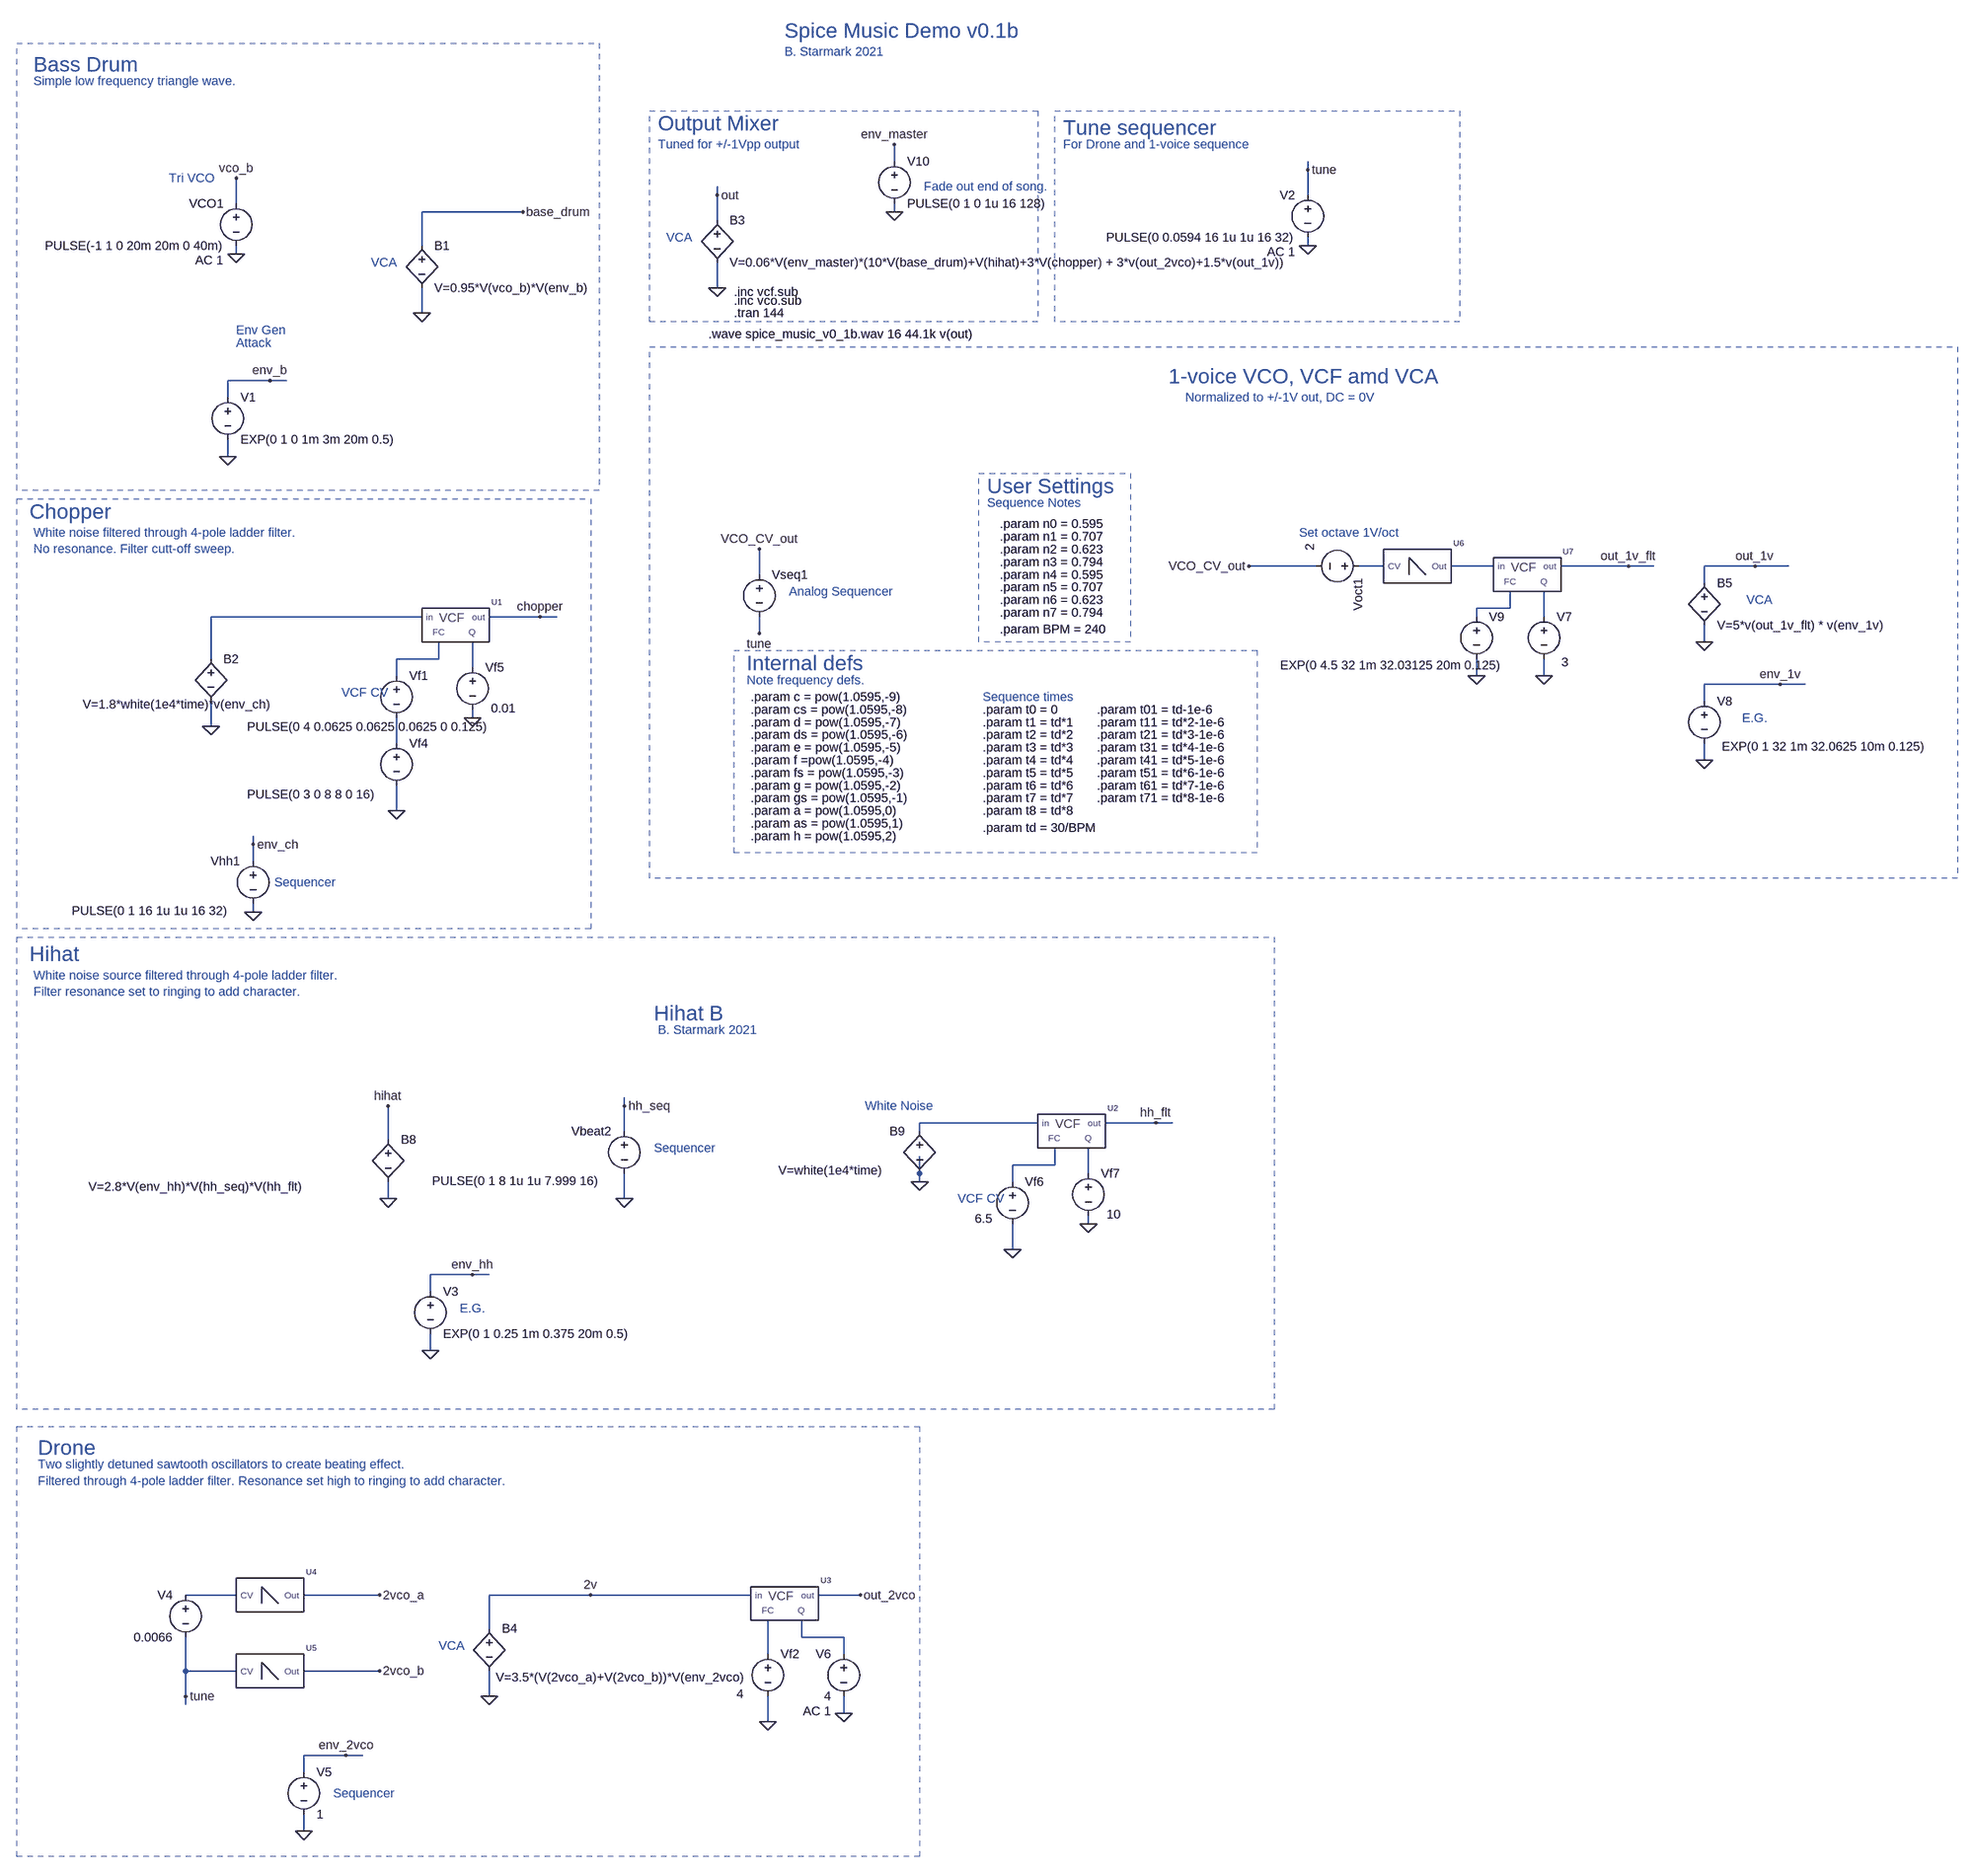
[diagram p0: schematic spice_music_v0_1b.asc]
spice_music_v0_1b.asc, the LTspice schematic file:
Version 4
SHEET 1 1780 5468
WIRE -240 -784 -240 -816
WIRE 544 -768 544 -784
WIRE -576 -720 -576 -736
WIRE 544 -720 544 -768
WIRE -1488 -704 -1488 -752
WIRE -944 -688 -1136 -688
WIRE -240 -688 -240 -704
WIRE -576 -672 -576 -720
WIRE -1136 -624 -1136 -688
WIRE 544 -624 544 -640
WIRE -1488 -608 -1488 -624
WIRE -576 -544 -576 -592
WIRE -1136 -496 -1136 -544
WIRE -1424 -368 -1504 -368
WIRE -1392 -368 -1424 -368
WIRE -1504 -336 -1504 -368
WIRE -1504 -224 -1504 -256
WIRE 560 -16 432 -16
WIRE 688 -16 640 -16
WIRE 896 -16 816 -16
WIRE 1152 -16 1024 -16
WIRE 1200 -16 1152 -16
WIRE 1392 -16 1296 -16
WIRE 1456 -16 1392 -16
WIRE -496 0 -496 -48
WIRE 1296 16 1296 -16
WIRE 928 64 928 32
WIRE 928 64 864 64
WIRE -1136 80 -1536 80
WIRE -912 80 -1008 80
WIRE -880 80 -912 80
WIRE 864 80 864 64
WIRE 992 80 992 32
WIRE -496 112 -496 80
WIRE 1296 128 1296 96
WIRE -1536 160 -1536 80
WIRE -1104 160 -1104 128
WIRE -1104 160 -1184 160
WIRE -1040 176 -1040 128
WIRE -1184 192 -1184 160
WIRE 864 192 864 160
WIRE 992 192 992 160
WIRE 1440 208 1296 208
WIRE 1488 208 1440 208
WIRE 1296 240 1296 208
WIRE -1040 272 -1040 256
WIRE -1536 288 -1536 240
WIRE -1184 320 -1184 272
WIRE 1296 352 1296 320
WIRE -1184 448 -1184 400
WIRE -1456 512 -1456 496
WIRE -1456 544 -1456 512
WIRE -1456 640 -1456 624
WIRE -752 1008 -752 992
WIRE 32 1040 -192 1040
WIRE 256 1040 160 1040
WIRE 288 1040 256 1040
WIRE -752 1056 -752 1008
WIRE -192 1056 -192 1040
WIRE -1200 1072 -1200 1008
WIRE 64 1120 64 1088
WIRE 64 1120 -16 1120
WIRE -192 1136 -192 1104
WIRE 128 1136 128 1088
WIRE -192 1152 -192 1136
WIRE -16 1152 -16 1120
WIRE -1200 1184 -1200 1152
WIRE -752 1184 -752 1136
WIRE 128 1232 128 1216
WIRE -16 1280 -16 1232
WIRE -1040 1328 -1120 1328
WIRE -1008 1328 -1040 1328
WIRE -1120 1360 -1120 1328
WIRE -1120 1472 -1120 1440
WIRE -1488 1936 -1584 1936
WIRE -1216 1936 -1360 1936
WIRE -816 1936 -1008 1936
WIRE -512 1936 -816 1936
WIRE -304 1936 -384 1936
WIRE -1008 2000 -1008 1936
WIRE -416 2016 -416 1984
WIRE -336 2016 -416 2016
WIRE -480 2048 -480 1984
WIRE -336 2048 -336 2016
WIRE -1584 2080 -1584 2016
WIRE -1488 2080 -1584 2080
WIRE -1216 2080 -1360 2080
WIRE -1584 2128 -1584 2080
WIRE -1008 2128 -1008 2080
WIRE -1584 2144 -1584 2128
WIRE -336 2160 -336 2128
WIRE -480 2176 -480 2128
WIRE -1280 2240 -1360 2240
WIRE -1248 2240 -1280 2240
WIRE -1360 2272 -1360 2240
WIRE -1360 2384 -1360 2352
FLAG -576 -544 0
FLAG -576 -720 out
FLAG -1456 640 0
FLAG -1456 512 env_ch
FLAG -1488 -608 0
FLAG -1136 -496 0
FLAG -1488 -752 vco_b
FLAG -944 -688 base_drum
FLAG -1504 -224 0
FLAG -1424 -368 env_b
FLAG -1536 288 0
FLAG -912 80 chopper
FLAG -1184 448 0
FLAG -1040 272 0
FLAG -1200 1008 hihat
FLAG -752 1184 0
FLAG -752 1008 hh_seq
FLAG -1200 1184 0
FLAG 256 1040 hh_flt
FLAG -192 1152 0
FLAG -1120 1472 0
FLAG -1040 1328 env_hh
FLAG 128 1232 0
FLAG -16 1280 0
FLAG -1008 2128 0
FLAG -816 1936 2v
FLAG -1360 2384 0
FLAG -1280 2240 env_2vco
FLAG -304 1936 out_2vco
FLAG -336 2160 0
FLAG -480 2176 0
FLAG -1216 1936 2vco_a
FLAG 544 -624 0
FLAG -1216 2080 2vco_b
FLAG 1296 128 0
FLAG 1392 -16 out_1v
FLAG -496 -48 VCO_CV_out
FLAG 432 -16 VCO_CV_out
FLAG 864 192 0
FLAG 992 192 0
FLAG 1152 -16 out_1v_flt
FLAG 1296 352 0
FLAG 1440 208 env_1v
FLAG 544 -768 tune
FLAG -1584 2128 tune
FLAG -496 112 tune
FLAG -240 -688 0
FLAG -240 -816 env_master
SYMBOL bv -576 -688 R0
SYMATTR InstName B3
SYMATTR Value V=0.06*V(env_master)*(10*V(base_drum)+V(hihat)+3*V(chopper) + 3*v(out_2vco)+1.5*v(out_1v))
SYMBOL voltage -1456 528 M0
WINDOW 123 24 124 Left 2
WINDOW 39 0 0 Left 2
WINDOW 3 47 110 Left 2
SYMATTR Value PULSE(0 1 16 1u 1u 16 32)
SYMATTR InstName Vhh1
SYMBOL voltage -1488 -720 M0
WINDOW 123 24 124 Left 2
WINDOW 39 0 0 Left 2
SYMATTR Value2 AC 1
SYMATTR InstName VCO1
SYMATTR Value PULSE(-1 1 0 20m 20m 0 40m)
SYMBOL bv -1136 -640 R0
SYMATTR InstName B1
SYMATTR Value V=0.95*V(vco_b)*V(env_b)
SYMBOL voltage -1504 -352 R0
WINDOW 123 0 0 Left 0
WINDOW 39 0 0 Left 0
SYMATTR InstName V1
SYMATTR Value EXP(0 1 0 1m 3m 20m 0.5)
SYMBOL voltage -1184 176 R0
WINDOW 123 0 0 Left 0
WINDOW 39 0 0 Left 0
WINDOW 3 -283 113 Left 2
SYMATTR Value PULSE(0 4 0.0625 0.0625 0.0625 0 0.125)
SYMATTR InstName Vf1
SYMBOL bv -1536 144 R0
WINDOW 3 -243 102 Left 2
SYMATTR Value V=1.8*white(1e4*time)*v(env_ch)
SYMATTR InstName B2
SYMBOL voltage -1184 304 R0
WINDOW 123 0 0 Left 0
WINDOW 39 0 0 Left 0
WINDOW 3 -283 113 Left 2
SYMATTR Value PULSE(0 3 0 8 8 0 16)
SYMATTR InstName Vf4
SYMBOL vcf -1072 48 R0
SYMATTR InstName U1
SYMBOL voltage -1040 160 R0
WINDOW 123 0 0 Left 0
WINDOW 39 0 0 Left 0
WINDOW 3 35 94 Left 2
SYMATTR Value 0.01
SYMATTR InstName Vf5
SYMBOL bv -1200 1056 R0
WINDOW 3 -568 105 Left 2
SYMATTR Value V=2.8*V(env_hh)*V(hh_seq)*V(hh_flt)
SYMATTR InstName B8
SYMBOL voltage -752 1040 M0
WINDOW 123 24 124 Left 2
WINDOW 39 0 0 Left 2
WINDOW 3 47 110 Left 2
SYMATTR Value PULSE(0 1 8 1u 1u 7.999 16)
SYMATTR InstName Vbeat2
SYMBOL bv -192 1040 R0
WINDOW 0 -57 16 Left 2
WINDOW 3 -268 90 Left 2
SYMATTR InstName B9
SYMATTR Value V=white(1e4*time)
SYMBOL voltage -1120 1344 R0
WINDOW 123 0 0 Left 0
WINDOW 39 0 0 Left 0
SYMATTR InstName V3
SYMATTR Value EXP(0 1 0.25 1m 0.375 20m 0.5)
SYMBOL voltage -16 1136 R0
WINDOW 123 0 0 Left 0
WINDOW 39 0 0 Left 0
WINDOW 3 -71 86 Left 2
SYMATTR Value 6.5
SYMATTR InstName Vf6
SYMBOL vcf 96 1008 R0
SYMATTR InstName U2
SYMBOL voltage 128 1120 R0
WINDOW 123 0 0 Left 0
WINDOW 39 0 0 Left 0
WINDOW 3 35 94 Left 2
SYMATTR Value 10
SYMATTR InstName Vf7
SYMBOL bv -1008 1984 R0
WINDOW 3 12 108 Left 2
SYMATTR Value V=3.5*(V(2vco_a)+V(2vco_b))*V(env_2vco)
SYMATTR InstName B4
SYMBOL voltage -480 2032 R0
WINDOW 123 0 0 Left 0
WINDOW 39 0 0 Left 0
WINDOW 3 -59 92 Left 2
SYMATTR Value 4
SYMATTR InstName Vf2
SYMBOL voltage -1360 2256 R0
WINDOW 123 0 0 Left 0
WINDOW 39 0 0 Left 0
SYMATTR InstName V5
SYMATTR Value 1
SYMBOL vcf -448 1904 R0
SYMATTR InstName U3
SYMBOL voltage -336 2032 M0
WINDOW 123 24 124 Left 2
WINDOW 39 0 0 Left 2
SYMATTR Value2 AC 1
SYMATTR InstName V6
SYMATTR Value 4
SYMBOL voltage 544 -736 M0
WINDOW 123 24 124 Left 2
WINDOW 39 0 0 Left 2
SYMATTR Value2 AC 1
SYMATTR InstName V2
SYMATTR Value PULSE(0 0.0594 16 1u 1u 16 32)
SYMBOL voltage -1584 1920 M0
WINDOW 123 24 124 Left 2
WINDOW 39 0 0 Left 2
SYMATTR InstName V4
SYMATTR Value 0.0066
SYMBOL vco -1424 1888 R0
SYMATTR InstName U4
SYMBOL vco -1424 2032 R0
SYMATTR InstName U5
SYMBOL bv 1296 0 R0
SYMATTR InstName B5
SYMATTR Value V=5*v(out_1v_flt) * v(env_1v)
SYMBOL voltage -496 -16 R0
WINDOW 3 28 110 Invisible 2
SYMATTR Value PWL REPEAT FOREVER ({t0} {n0} {t01} {n0} {t1} {n1} {t11} {n1} {t2} {n2} {t21} {n2} {t3} {n3} {t31} {n3} {t4} {n4} {t41} {n4} {t5} {n5} {t51} {n5} {t6} {n6} {t61} {n6} {t7} {n7} {t71} {n7} {t8} {n0}) ENDREPEAT
SYMATTR InstName Vseq1
SYMBOL vco 752 -64 R0
SYMATTR InstName U6
SYMBOL vcf 960 -48 R0
SYMATTR InstName U7
SYMBOL voltage 992 64 R0
WINDOW 123 0 0 Left 0
WINDOW 39 0 0 Left 0
WINDOW 3 33 102 Left 2
SYMATTR Value 3
SYMATTR InstName V7
SYMBOL voltage 1296 224 R0
WINDOW 123 0 0 Left 0
WINDOW 39 0 0 Left 0
WINDOW 3 33 102 Left 2
SYMATTR Value EXP(0 1 32 1m 32.0625 10m 0.125)
SYMATTR InstName V8
SYMBOL voltage 656 -16 R90
WINDOW 123 0 0 Left 0
WINDOW 39 0 0 Left 0
WINDOW 3 -43 108 Left 2
SYMATTR Value 2
SYMATTR InstName Voct1
SYMBOL voltage 864 64 R0
WINDOW 123 0 0 Left 0
WINDOW 39 0 0 Left 0
WINDOW 3 -372 108 Left 2
SYMATTR Value EXP(0 4.5 32 1m 32.03125 20m 0.125)
SYMATTR InstName V9
SYMBOL voltage -240 -800 R0
WINDOW 123 0 0 Left 0
WINDOW 39 0 0 Left 0
SYMATTR InstName V10
SYMATTR Value PULSE(0 1 0 1u 16 128)
TEXT -448 -1032 Left 4 ;Spice Music Demo v0.1b
TEXT -448 -992 Left 2 ;B. Starmark 2021
TEXT -1872 -968 Left 4 ;Bass Drum
TEXT -1880 -120 Left 4 ;Chopper
TEXT -672 -640 Left 2 ;VCA
TEXT -1880 720 Left 4 ;Hihat
TEXT -688 -856 Left 4 ;Output Mixer
TEXT -1864 1656 Left 4 ;Drone
TEXT -1872 760 Left 2 ;White noise source filtered through 4-pole ladder filter.\nFilter resonance set to ringing to add character.
TEXT -1872 -936 Left 2 ;Simple low frequency triangle wave.
TEXT -1872 -80 Left 2 ;White noise filtered through 4-pole ladder filter.\nNo resonance. Filter cutt-off sweep.
TEXT -1864 1688 Left 2 ;Two slightly detuned sawtooth oscillators to create beating effect.\nFiltered through 4-pole ladder filter. Resonance set high to ringing to add character.
TEXT -688 -816 Left 2 ;Tuned for +/-1Vpp output
TEXT -1488 -440 Left 2 ;Attack
TEXT -1232 -592 Left 2 ;VCA
TEXT -1488 -464 Left 2 ;Env Gen
TEXT -1616 -752 Left 2 ;Tri VCO
TEXT -1288 224 Left 2 ;VCF CV
TEXT -696 1088 Left 2 ;Sequencer
TEXT -296 1008 Left 2 ;White Noise
TEXT -696 832 Left 4 ;Hihat B
TEXT -688 864 Left 2 ;B. Starmark 2021
TEXT -120 1184 Left 2 ;VCF CV
TEXT -1104 2032 Left 2 ;VCA
TEXT -544 -536 Left 2 !.inc vcf.sub
TEXT -592 -456 Left 2 !.wave spice_music_v0_1b.wav 16 44.1k v(out)
TEXT -544 -520 Left 2 !.inc vco.sub
TEXT -544 -496 Left 2 !.tran 144
TEXT 280 -376 Left 4 ;1-voice VCO, VCF amd VCA
TEXT 312 -336 Left 2 ;Normalized to +/-1V out, DC = 0V
TEXT -440 32 Left 2 ;Analog Sequencer
TEXT -520 200 Left 2 ;Note frequency defs.
TEXT -64 -136 Left 2 ;Sequence Notes
TEXT -72 232 Left 2 ;Sequence times
TEXT -72 256 Left 2 !.param t0 = 0
TEXT 144 256 Left 2 !.param t01 = td-1e-6
TEXT -72 480 Left 2 !.param td = 30/BPM
TEXT -72 280 Left 2 !.param t1 = td*1
TEXT 144 280 Left 2 !.param t11 = td*2-1e-6
TEXT -72 304 Left 2 !.param t2 = td*2
TEXT 144 304 Left 2 !.param t21 = td*3-1e-6
TEXT 144 328 Left 2 !.param t31 = td*4-1e-6
TEXT -72 328 Left 2 !.param t3 = td*3
TEXT -72 352 Left 2 !.param t4 = td*4
TEXT 144 352 Left 2 !.param t41 = td*5-1e-6
TEXT -72 376 Left 2 !.param t5 = td*5
TEXT 144 376 Left 2 !.param t51 = td*6-1e-6
TEXT 144 400 Left 2 !.param t61 = td*7-1e-6
TEXT -72 400 Left 2 !.param t6 = td*6
TEXT 144 424 Left 2 !.param t71 = td*8-1e-6
TEXT -72 424 Left 2 !.param t7 = td*7
TEXT -520 168 Left 4 ;Internal defs
TEXT -64 -168 Left 4 ;User Settings
TEXT -72 448 Left 2 !.param t8 = td*8
TEXT 1376 48 Left 2 ;VCA
TEXT -40 -72 Left 2 !.param n1 = 0.707
TEXT -40 -48 Left 2 !.param n2 = 0.623
TEXT -40 -24 Left 2 !.param n3 = 0.794
TEXT -40 0 Left 2 !.param n4 = 0.595
TEXT -40 24 Left 2 !.param n5 = 0.707
TEXT -40 48 Left 2 !.param n6 = 0.623
TEXT -40 72 Left 2 !.param n7 = 0.794
TEXT -40 104 Left 2 !.param BPM = 240
TEXT -40 -96 Left 2 !.param n0 = 0.595
TEXT 528 -80 Left 2 ;Set octave 1V/oct
TEXT 80 -848 Left 4 ;Tune sequencer
TEXT 80 -816 Left 2 ;For Drone and 1-voice sequence
TEXT 1368 272 Left 2 ;E.G.
TEXT -1416 584 Left 2 ;Sequencer
TEXT -1064 1392 Left 2 ;E.G.
TEXT -1304 2312 Left 2 ;Sequencer
TEXT -184 -736 Left 2 ;Fade out end of song.
TEXT -512 280 Left 2 !.param d = pow(1.0595,-7)
TEXT -512 304 Left 2 !.param ds = pow(1.0595,-6)
TEXT -512 328 Left 2 !.param e = pow(1.0595,-5)
TEXT -512 352 Left 2 !.param f =pow(1.0595,-4)
TEXT -512 376 Left 2 !.param fs = pow(1.0595,-3)
TEXT -512 400 Left 2 !.param g = pow(1.0595,-2)
TEXT -512 424 Left 2 !.param gs = pow(1.0595,-1)
TEXT -512 448 Left 2 !.param a = pow(1.0595,0)
TEXT -512 472 Left 2 !.param as = pow(1.0595,1)
TEXT -512 496 Left 2 !.param h = pow(1.0595,2)
TEXT -512 256 Left 2 !.param cs = pow(1.0595,-8)
TEXT -512 232 Left 2 !.param c = pow(1.0595,-9)
RECTANGLE Normal -800 -160 -1904 -1008 2
RECTANGLE Normal -816 672 -1904 -144 2
RECTANGLE Normal 32 -480 -704 -880 2
RECTANGLE Normal 480 1584 -1904 688 2
RECTANGLE Normal -192 2432 -1904 1616 2
RECTANGLE Normal 448 528 -544 144 2
RECTANGLE Normal 208 128 -80 -192 2
RECTANGLE Normal 1776 576 -704 -432 2
RECTANGLE Normal 832 -480 64 -880 2

The netlist it stands for:
* spice_music_v0_1b.asc
B3 out 0 V=0.06*V(env_master)*(10*V(base_drum)+V(hihat)+3*V(chopper) + 3*v(out_2vco)+1.5*v(out_1v))
Vhh1 env_ch 0 PULSE(0 1 16 1u 1u 16 32)
VCO1 vco_b 0 PULSE(-1 1 0 20m 20m 0 40m) AC 1
B1 base_drum 0 V=0.95*V(vco_b)*V(env_b)
V1 env_b 0 EXP(0 1 0 1m 3m 20m 0.5)
Vf1 N006 N008 PULSE(0 4 0.0625 0.0625 0.0625 0 0.125)
B2 N004 0 V=1.8*white(1e4*time)*v(env_ch)
Vf4 N008 0 PULSE(0 3 0 8 8 0 16)
XU1 N004 chopper N006 N007 vcf  ; pins in out FC Q
Vf5 N007 0 0.01
B8 hihat 0 V=2.8*V(env_hh)*V(hh_seq)*V(hh_flt)
Vbeat2 hh_seq 0 PULSE(0 1 8 1u 1u 7.999 16)
B9 N009 0 V=white(1e4*time)
V3 env_hh 0 EXP(0 1 0.25 1m 0.375 20m 0.5)
Vf6 N010 0 6.5
XU2 N009 hh_flt N010 N011 vcf  ; pins in out FC Q
Vf7 N011 0 10
B4 2v 0 V=3.5*(V(2vco_a)+V(2vco_b))*V(env_2vco)
Vf2 N014 0 4
V5 env_2vco 0 1
XU3 2v out_2vco N014 N013 vcf  ; pins in out FC Q
V6 N013 0 4 AC 1
V2 tune 0 PULSE(0 0.0594 16 1u 1u 16 32) AC 1
V4 N012 tune 0.0066
XU4 N012 2vco_a vco  ; pins CV Out
XU5 tune 2vco_b vco  ; pins CV Out
B5 out_1v 0 V=5*v(out_1v_flt) * v(env_1v)
Vseq1 VCO_CV_out tune PWL REPEAT FOREVER ({t0} {n0} {t01} {n0} {t1} {n1} {t11} {n1} {t2} {n2} {t21} {n2} {t3} {n3} {t31} {n3} {t4} {n4} {t41} {n4} {t5} {n5} {t51} {n5} {t6} {n6} {t61} {n6} {t7} {n7} {t71} {n7} {t8} {n0}) ENDREPEAT
XU6 N001 N002 vco  ; pins CV Out
XU7 N002 out_1v_flt N003 N005 vcf  ; pins in out FC Q
V7 N005 0 3
V8 env_1v 0 EXP(0 1 32 1m 32.0625 10m 0.125)
Voct1 N001 VCO_CV_out 2
V9 N003 0 EXP(0 4.5 32 1m 32.03125 20m 0.125)
V10 env_master 0 PULSE(0 1 0 1u 16 128)
* Spice Music Demo v0.1b
* B. Starmark 2021
* Bass Drum
* Chopper
* VCA
* Hihat
* Output Mixer
* Drone
* White noise source filtered through 4-pole ladder filter.
* Filter resonance set to ringing to add character.
* Simple low frequency triangle wave.
* White noise filtered through 4-pole ladder filter.
* No resonance. Filter cutt-off sweep.
* Two slightly detuned sawtooth oscillators to create beating effect.
* Filtered through 4-pole ladder filter. Resonance set high to ringing to add character.
* Tuned for +/-1Vpp output
* Attack
* VCA
* Env Gen
* Tri VCO
* VCF CV
* Sequencer
* White Noise
* Hihat B
* B. Starmark 2021
* VCF CV
* VCA
.inc vcf.sub
.wave spice_music_v0_1b.wav 16 44.1k v(out)
.inc vco.sub
.tran 144
* 1-voice VCO, VCF amd VCA
* Normalized to +/-1V out, DC = 0V
* Analog Sequencer
* Note frequency defs.
* Sequence Notes
* Sequence times
.param t0 = 0
.param t01 = td-1e-6
.param td = 30/BPM
.param t1 = td*1
.param t11 = td*2-1e-6
.param t2 = td*2
.param t21 = td*3-1e-6
.param t31 = td*4-1e-6
.param t3 = td*3
.param t4 = td*4
.param t41 = td*5-1e-6
.param t5 = td*5
.param t51 = td*6-1e-6
.param t61 = td*7-1e-6
.param t6 = td*6
.param t71 = td*8-1e-6
.param t7 = td*7
* Internal defs
* User Settings
.param t8 = td*8
* VCA
.param n1 = 0.707
.param n2 = 0.623
.param n3 = 0.794
.param n4 = 0.595
.param n5 = 0.707
.param n6 = 0.623
.param n7 = 0.794
.param BPM = 240
.param n0 = 0.595
* Set octave 1V/oct
* Tune sequencer
* For Drone and 1-voice sequence
* E.G.
* Sequencer
* E.G.
* Sequencer
* Fade out end of song.
.param d = pow(1.0595,-7)
.param ds = pow(1.0595,-6)
.param e = pow(1.0595,-5)
.param f =pow(1.0595,-4)
.param fs = pow(1.0595,-3)
.param g = pow(1.0595,-2)
.param gs = pow(1.0595,-1)
.param a = pow(1.0595,0)
.param as = pow(1.0595,1)
.param h = pow(1.0595,2)
.param cs = pow(1.0595,-8)
.param c = pow(1.0595,-9)
.backanno
.end